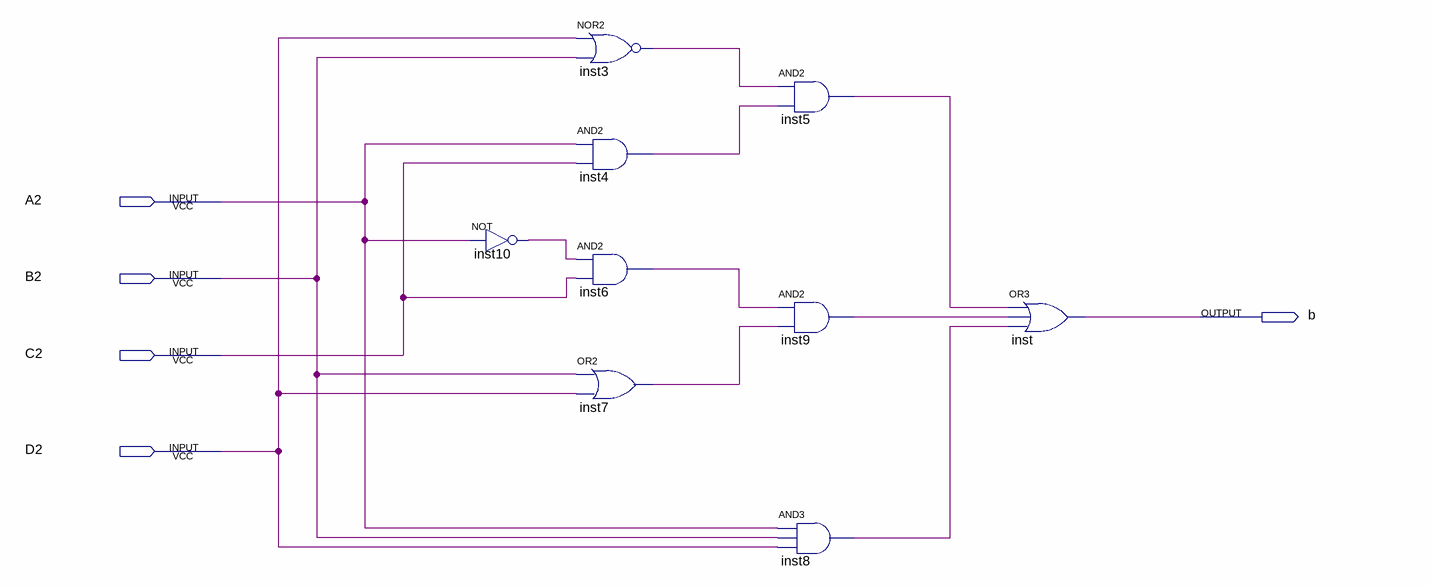
[diagram p0: schematic sheet]
// Quartus schematic Segment_b.bdf as structural Verilog: 9 symbols, 5 pins
module Segment_b (
  input  A2,
  input  B2,
  input  C2,
  input  D2,
  output b
);

  wire inst3_out, inst4_out, inst5_out, inst6_out, inst7_out, inst8_out, inst9_out, inst10_out;

  not inst10 (inst10_out, A2);
  nor inst3 (inst3_out, D2, B2);
  and inst4 (inst4_out, A2, C2);
  and inst6 (inst6_out, inst10_out, C2);
  or inst7 (inst7_out, B2, D2);
  and inst5 (inst5_out, inst3_out, inst4_out);
  and inst9 (inst9_out, inst6_out, inst7_out);
  and inst8 (inst8_out, A2, B2, D2);
  or inst (b, inst5_out, inst9_out, inst8_out);
endmodule
